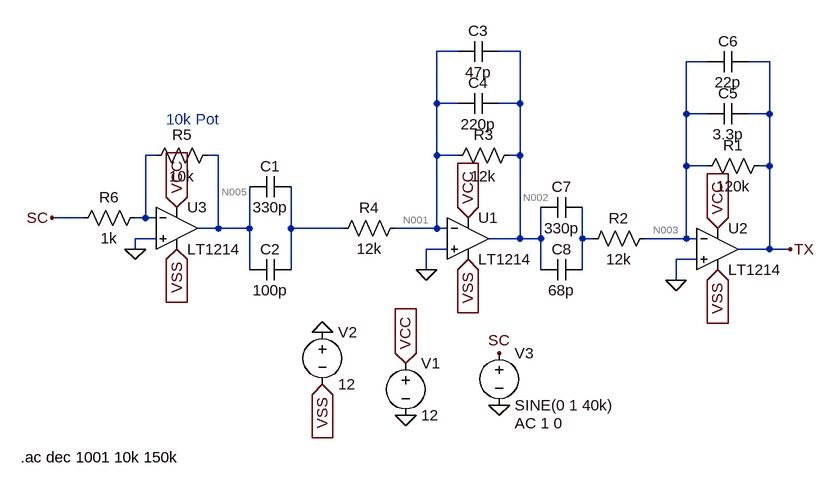
[diagram p0: schematic TxFinal.asc]
TxFinal.asc, the LTspice schematic file:
Version 4
SHEET 1 1104 680
WIRE 544 -32 512 -32
WIRE 640 -32 608 -32
WIRE 928 -16 896 -16
WIRE 1024 -16 992 -16
WIRE 512 48 512 -32
WIRE 544 48 512 48
WIRE 640 48 640 -32
WIRE 640 48 608 48
WIRE 896 64 896 -16
WIRE 928 64 896 64
WIRE 1024 64 1024 -16
WIRE 1024 64 992 64
WIRE 80 128 64 128
WIRE 176 128 160 128
WIRE 512 128 512 48
WIRE 544 128 512 128
WIRE 640 128 640 48
WIRE 640 128 624 128
WIRE 896 144 896 64
WIRE 928 144 896 144
WIRE 1024 144 1024 64
WIRE 1024 144 1008 144
WIRE -32 224 -80 224
WIRE 64 224 64 128
WIRE 64 224 48 224
WIRE 80 224 64 224
WIRE 176 240 176 128
WIRE 176 240 144 240
WIRE 224 240 224 176
WIRE 224 240 176 240
WIRE 288 240 288 176
WIRE 368 240 288 240
WIRE 512 240 512 128
WIRE 512 240 448 240
WIRE 528 240 512 240
WIRE 80 256 48 256
WIRE 640 256 640 128
WIRE 640 256 592 256
WIRE 672 256 672 208
WIRE 672 256 640 256
WIRE 736 256 736 208
WIRE 752 256 736 256
WIRE 896 256 896 144
WIRE 896 256 832 256
WIRE 912 256 896 256
WIRE 48 272 48 256
WIRE 528 272 496 272
WIRE 1024 272 1024 144
WIRE 1024 272 976 272
WIRE 1056 272 1024 272
WIRE 912 288 880 288
WIRE 224 304 224 240
WIRE 288 304 288 240
WIRE 496 304 496 272
WIRE 672 304 672 256
WIRE 736 304 736 256
WIRE 880 320 880 288
FLAG 880 320 0
FLAG 944 240 VCC
IOPIN 944 240 In
FLAG 944 304 VSS
IOPIN 944 304 In
FLAG 496 304 0
FLAG 560 224 VCC
IOPIN 560 224 In
FLAG 560 288 VSS
IOPIN 560 288 In
FLAG 48 272 0
FLAG -80 224 SC
FLAG 112 272 VSS
IOPIN 112 272 In
FLAG 112 208 VCC
IOPIN 112 208 In
FLAG 1056 272 TX
FLAG 464 528 0
FLAG 336 400 0
FLAG 464 448 VCC
IOPIN 464 448 In
FLAG 336 480 VSS
IOPIN 336 480 In
FLAG 608 512 0
FLAG 608 432 SC
SYMBOL res 1024 128 R90
WINDOW 0 0 56 VBottom 2
WINDOW 3 32 56 VTop 2
SYMATTR InstName R1
SYMATTR Value 120k
SYMBOL res 848 240 R90
WINDOW 0 0 56 VBottom 2
WINDOW 3 32 56 VTop 2
SYMATTR InstName R2
SYMATTR Value 12k
SYMBOL res 640 112 R90
WINDOW 0 0 56 VBottom 2
WINDOW 3 32 56 VTop 2
SYMATTR InstName R3
SYMATTR Value 12k
SYMBOL res 464 224 R90
WINDOW 0 0 56 VBottom 2
WINDOW 3 32 56 VTop 2
SYMATTR InstName R4
SYMATTR Value 12k
SYMBOL Opamps\\LT1214 560 192 R0
SYMATTR InstName U1
SYMBOL Opamps\\LT1214 944 208 R0
SYMATTR InstName U2
SYMBOL cap 288 160 R90
WINDOW 0 0 32 VBottom 2
WINDOW 3 32 32 VTop 2
SYMATTR InstName C1
SYMATTR Value 330p
SYMBOL cap 288 288 R90
WINDOW 0 0 32 VBottom 2
WINDOW 3 32 32 VTop 2
SYMATTR InstName C2
SYMATTR Value 100p
SYMBOL cap 608 -48 R90
WINDOW 0 0 32 VBottom 2
WINDOW 3 32 32 VTop 2
SYMATTR InstName C3
SYMATTR Value 47p
SYMBOL cap 608 32 R90
WINDOW 0 0 32 VBottom 2
WINDOW 3 32 32 VTop 2
SYMATTR InstName C4
SYMATTR Value 220p
SYMBOL cap 992 48 R90
WINDOW 0 0 32 VBottom 2
WINDOW 3 32 32 VTop 2
SYMATTR InstName C5
SYMATTR Value 3.3p
SYMBOL cap 736 192 R90
WINDOW 0 0 32 VBottom 2
WINDOW 3 32 32 VTop 2
SYMATTR InstName C7
SYMATTR Value 330p
SYMBOL cap 736 288 R90
WINDOW 0 0 32 VBottom 2
WINDOW 3 32 32 VTop 2
SYMATTR InstName C8
SYMATTR Value 68p
SYMBOL Opamps\\LT1214 112 176 R0
SYMATTR InstName U3
SYMBOL res 176 112 R90
WINDOW 0 0 56 VBottom 2
WINDOW 3 32 56 VTop 2
SYMATTR InstName R5
SYMATTR Value 10k
SYMBOL res 64 208 R90
WINDOW 0 0 56 VBottom 2
WINDOW 3 32 56 VTop 2
SYMATTR InstName R6
SYMATTR Value 1k
SYMBOL voltage 464 432 R0
WINDOW 123 0 0 Left 0
WINDOW 39 0 0 Left 0
SYMATTR InstName V1
SYMATTR Value 12
SYMBOL voltage 336 384 R0
WINDOW 123 0 0 Left 0
WINDOW 39 0 0 Left 0
SYMATTR InstName V2
SYMATTR Value 12
SYMBOL voltage 608 416 R0
WINDOW 123 24 124 Left 2
WINDOW 39 0 0 Left 0
SYMATTR Value2 AC 1 0
SYMATTR InstName V3
SYMATTR Value SINE(0 1 40k)
SYMBOL cap 992 -32 R90
WINDOW 0 0 32 VBottom 2
WINDOW 3 32 32 VTop 2
SYMATTR InstName C6
SYMATTR Value 22p
TEXT -128 592 Left 2 !.ac dec 1001 10k 150k
TEXT 96 72 Left 2 ;10k Pot

The netlist it stands for:
* TxFinal.asc
R1 TX N003 120k
R2 N003 N007 12k
R3 N002 N001 12k
R4 N001 N006 12k
XU1 0 N001 VCC VSS N002 LT1213  ; LT1214, pins In+ In- V+ V- OUT
XU2 0 N003 VCC VSS TX LT1213  ; LT1214, pins In+ In- V+ V- OUT
C1 N006 N005 330p
C2 N006 N005 100p
C3 N002 N001 47p
C4 N002 N001 220p
C5 TX N003 3.3p
C7 N007 N002 330p
C8 N007 N002 68p
XU3 0 N004 VCC VSS N005 LT1213  ; LT1214, pins In+ In- V+ V- OUT
R5 N005 N004 10k
R6 N004 SC 1k
V1 VCC 0 12
V2 0 VSS 12
V3 SC 0 SINE(0 1 40k) AC 1 0
C6 TX N003 22p
.ac dec 1001 10k 150k
* 10k Pot
.lib LTC.lib
.backanno
.end

* Results of the author's LTspice run, read from the files saved beside the schematic
* Operating Point, zero values left out:
*   V(tx) = -9.6 mV
*   V(n002) = -960 µV
*   V(vcc) = 12 V
*   V(vss) = -12 V
*   V(n005) = -800 µV
*   I(R5) = -80 nA
*   I(R3) = -80 nA
*   I(R1) = -80 nA
*   I(V2) = -8.1 mA
*   I(V1) = -8.101 mA
*   Ix(u1:1) = -80 nA
*   Ix(u1:2) = -80 nA
*   Ix(u1:3) = 2.7 mA
*   Ix(u1:4) = -2.7 mA
*   Ix(u1:5) = 80 nA
*   Ix(u2:1) = -80 nA
*   Ix(u2:2) = -80 nA
*   Ix(u2:3) = 2.7 mA
*   Ix(u2:4) = -2.7 mA
*   Ix(u2:5) = 80 nA
*   Ix(u3:1) = -80 nA
*   Ix(u3:2) = -80 nA
*   Ix(u3:3) = 2.7 mA
*   Ix(u3:4) = -2.7 mA
*   Ix(u3:5) = 80 nA
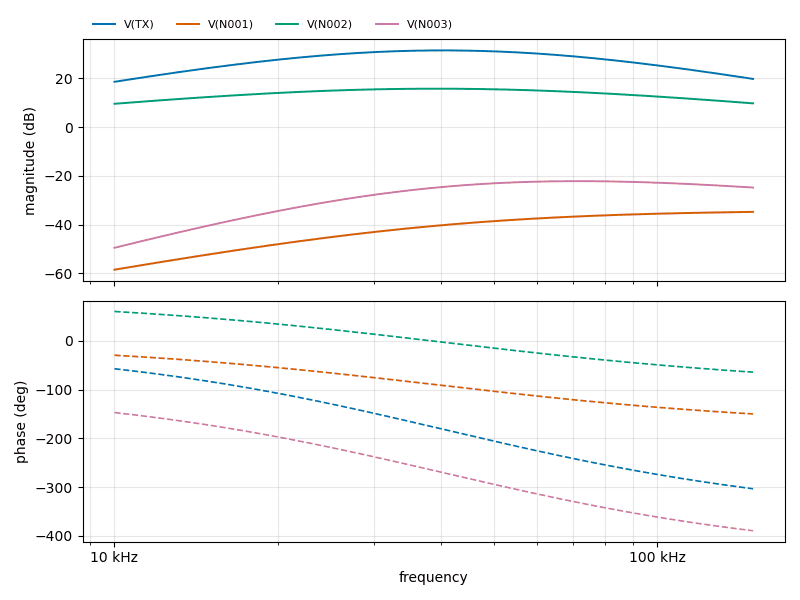
[diagram p1: AC Analysis of TxFinal.asc, plotted from the saved traces]
* AC Analysis, 1 run:
*   V(TX): 18.63 dB at 10 kHz, 19.82 dB at 150 kHz, peak 31.53 dB at 40.31 kHz, 3 dB below the peak at 21.71 kHz and 74.69 kHz
*   V(N001): -58.55 dB at 10 kHz, -34.80 dB at 150 kHz, peak -34.80 dB at 150 kHz, 3 dB below the peak at 56.74 kHz
*   V(N002): 9.61 dB at 10 kHz, 9.78 dB at 150 kHz, peak 15.81 dB at 39.12 kHz, 3 dB below the peak at 15.89 kHz and 96.41 kHz
*   V(N003): -49.55 dB at 10 kHz, -24.81 dB at 150 kHz, peak -22.18 dB at 71.47 kHz, 3 dB below the peak at 37.6 kHz